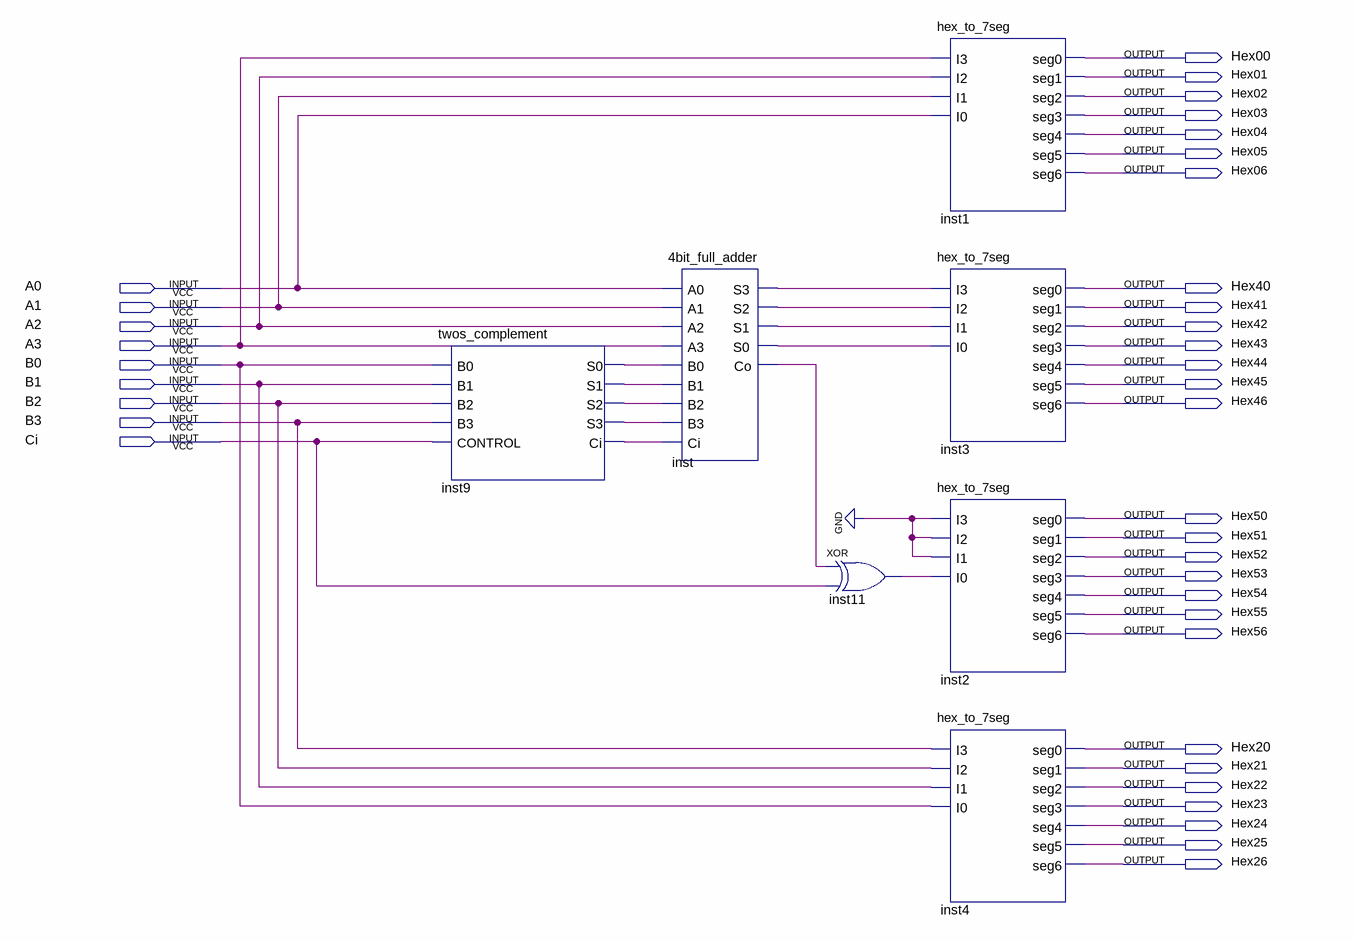
[diagram p0: schematic sheet]
// Quartus schematic lab001.bdf as structural Verilog: 7 symbols, 37 pins
module lab001 (
  input  A0,
  input  A1,
  input  A2,
  input  A3,
  input  B0,
  input  B1,
  input  B2,
  input  B3,
  input  Ci,
  output Hex00,
  output Hex01,
  output Hex02,
  output Hex03,
  output Hex04,
  output Hex05,
  output Hex06,
  output Hex40,
  output Hex41,
  output Hex42,
  output Hex43,
  output Hex44,
  output Hex45,
  output Hex46,
  output Hex50,
  output Hex51,
  output Hex52,
  output Hex53,
  output Hex54,
  output Hex55,
  output Hex56,
  output Hex20,
  output Hex21,
  output Hex22,
  output Hex23,
  output Hex24,
  output Hex25,
  output Hex26
);

  wire inst9_ci, inst9_s0, inst9_s1, inst9_s2, inst9_s3, inst11_out, inst_co, inst_s0, inst_s1, inst_s2,
       inst_s3;

  twos_complement inst9 (
    .B0(B0), .B1(B1), .B2(B2), .B3(B3), .CONTROL(Ci), .S0(inst9_s0), .S1(inst9_s1), .S2(inst9_s2),
    .S3(inst9_s3), .Ci(inst9_ci));
  \4bit_full_adder  inst (
    .A0(A0), .A1(A1), .A2(A2), .A3(A3), .B0(inst9_s0), .B1(inst9_s1), .B2(inst9_s2), .B3(inst9_s3),
    .Ci(inst9_ci), .S3(inst_s3), .S2(inst_s2), .S1(inst_s1), .S0(inst_s0), .Co(inst_co));
  xor inst11 (inst11_out, inst_co, Ci);
  hex_to_7seg inst1 (
    .I3(A3), .I2(A2), .I1(A1), .I0(A0), .seg0(Hex00), .seg1(Hex01), .seg2(Hex02), .seg3(Hex03), .seg4(Hex04),
    .seg5(Hex05), .seg6(Hex06));
  hex_to_7seg inst3 (
    .I3(inst_s3), .I2(inst_s2), .I1(inst_s1), .I0(inst_s0), .seg0(Hex40), .seg1(Hex41), .seg2(Hex42),
    .seg3(Hex43), .seg4(Hex44), .seg5(Hex45), .seg6(Hex46));
  hex_to_7seg inst2 (
    .I3(1'b0), .I2(1'b0), .I1(1'b0), .I0(inst11_out), .seg0(Hex50), .seg1(Hex51), .seg2(Hex52), .seg3(Hex53),
    .seg4(Hex54), .seg5(Hex55), .seg6(Hex56));
  hex_to_7seg inst4 (
    .I3(B3), .I2(B2), .I1(B1), .I0(B0), .seg0(Hex20), .seg1(Hex21), .seg2(Hex22), .seg3(Hex23), .seg4(Hex24),
    .seg5(Hex25), .seg6(Hex26));
endmodule
